# Altium project GPT_PCB.PrjPcb
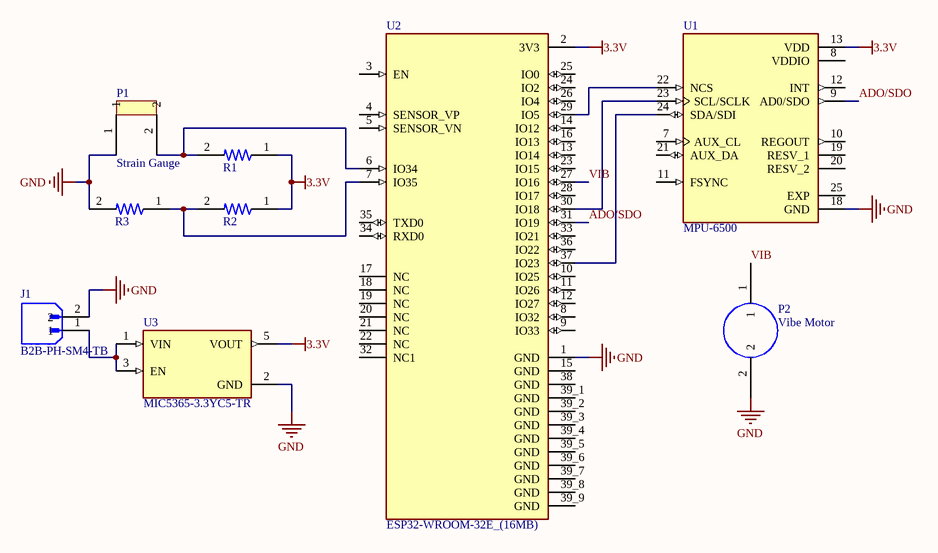
[diagram p0: GPT_Schematic.SchDoc]
1 sheet, 9 parts. Net scope: global (net labels, ports and power ports of the same name join across sheets).
Board files: Upperarm_GPT.PcbDoc, Forearm_GPT.PcbDoc

## Sheet GPT_Schematic.SchDoc
size Letter; SheetNumber: 1; SheetTotal: 1

### Parts
J1  B2B-PH-SM4-TB  [JST_B2B-PH-SM4-TB]
P1  Strain Gauge  [Strain Gauge]
P2  Vibe Motor  [Vibe Motor]
R1  RC0603FR-07100RL  [RESC1607X60N]  (value not drawn)
R2  RC0603FR-07100RL  [RESC1607X60N]  (value not drawn)
R3  RC0603FR-07100RL  [RESC1607X60N]  (value not drawn)
U1  MPU-6500  [QFN40P300X300X95-25N]
U2  ESP32-WROOM-32E_(16MB)  [XCVR_ESP32-WROOM-32E_(16MB)]
U3  MIC5365-3.3YC5-TR  [SOT65P210X110-5N]

### Nets
3.3V: R1.1 R2.1 U1.13(VDD) U2.2(3V3) U3.5(VOUT)
GND: J1.2 P1.1 P2.2 R3.2 U1.18(GND) U2.1(GND) U3.2(GND)
ADO/SDO: U1.9(AD0/SDO) U2.31(IO19)
VIB: P2.1 U2.27(IO16)
NetJ1_1: J1.1 U3.1(VIN) U3.3(EN)
NetP1_2: P1.2 R1.2 U2.6(IO34)
NetR2_2: R2.2 R3.1 U2.7(IO35)
NetU1_22: U1.22(NCS) U2.29(IO5)
NetU1_23: U1.23(SCL/SCLK) U2.30(IO18)
NetU1_24: U1.24(SDA/SDI) U2.37(IO23)

Not connected (* = marked no-connect by the designer): U1 7(AUX_CL) 8(VDDIO) 10(REGOUT) 11(FSYNC) 12(INT) 19(RESV_1) 20(RESV_2) 21(AUX_DA) 25(EXP); U2 3(EN) 4(SENSOR_VP) 5(SENSOR_VN) 8(IO32) 9(IO33) 10(IO25) 11(IO26) 12(IO27) 13(IO14) 14(IO12) 15(GND) 16(IO13) 17(NC) 18(NC) 19(NC) 20(NC) 21(NC) 22(NC) 23(IO15) 24(IO2) 25(IO0) 26(IO4) 28(IO17) 32(NC1) 33(IO21) 34(RXD0) 35(TXD0) 36(IO22) 38(GND) 39_1(GND) 39_2(GND) 39_3(GND) 39_4(GND) 39_5(GND) 39_6(GND) 39_7(GND) 39_8(GND) 39_9(GND)

### Library data of the parts
J1 = B2B-PH-SM4-TB: Connector Header Surface Mount 2 position 0.079 (2.00mm); MF: JST; Check_prices: https://www.snapeda.com/parts/B2B-PH-SM4-TB/JST/view-part/?ref=eda; Package: NON STANDARD-2 JST; MP: B2B-PH-SM4-TB; Value: *; Purchase-URL: https://pricing.snapeda.com/search/part/B2B-PH-SM4-TB/?ref=eda; SnapEDA_Link: https://www.snapeda.com/parts/B2B-PH-SM4-TB/JST/view-part/?ref=snap; Availability: In Stock; Price: None
R1-R3 = RC0603FR-07100RL: RES SMT 100R 1% 0603 T/R PICK#92931; Package: None; MP: RC0603FR-07100RL; Availability: Unavailable; Price: None; Value: *
U1 = MPU-6500: Accelerometer, Gyroscope, 6 Axis Sensor IÂ²C, SPI Output; MF: TDK InvenSense; Price: None; Value: *; Package: QFN-24 TDK; Mouser-Purchase-URL: https://snapeda.com/shop?store=Mouser&id=48597; SnapEDA_Link: https://www.snapeda.com/parts/MPU-6500/TDK%20InvenSense/view-part/48597/?ref=snap; DigiKey-Purchase-URL: https://snapeda.com/shop?store=DigiKey&id=48597; MP: MPU-6500; Availability: Warning
U2 = ESP32-WROOM-32E_(16MB): Bluetooth, WiFi 802.11b/g/n, Bluetooth v4.2 +EDR, Class 1, 2 and 3 Transceiver Module 2.4GHz ~ 2.5GHz Integrated, Trace Surface Mount; MP: ESP32-WROOM-32E (16MB); MF: Espressif Systems; Price: None; Availability: Not in stock; Package: None; Value: *; SnapEDA_Link: https://www.snapeda.com/parts/ESP32-WROOM-32E%20(16MB)/Espressif+Systems/view-part/?ref=snap; Check_prices: https://www.snapeda.com/parts/ESP32-WROOM-32E%20(16MB)/Espressif+Systems/view-part/?ref=eda
U3 = MIC5365-3.3YC5-TR: Linear Voltage Regulator IC 1 Output 150mA SC-70-5; Package: None; Price: None; Value: *; MP: MIC5365-3.3YC5-TR; Availability: Unavailable